# EAGLE design bbhTiny84 (EAGLE 6.4)
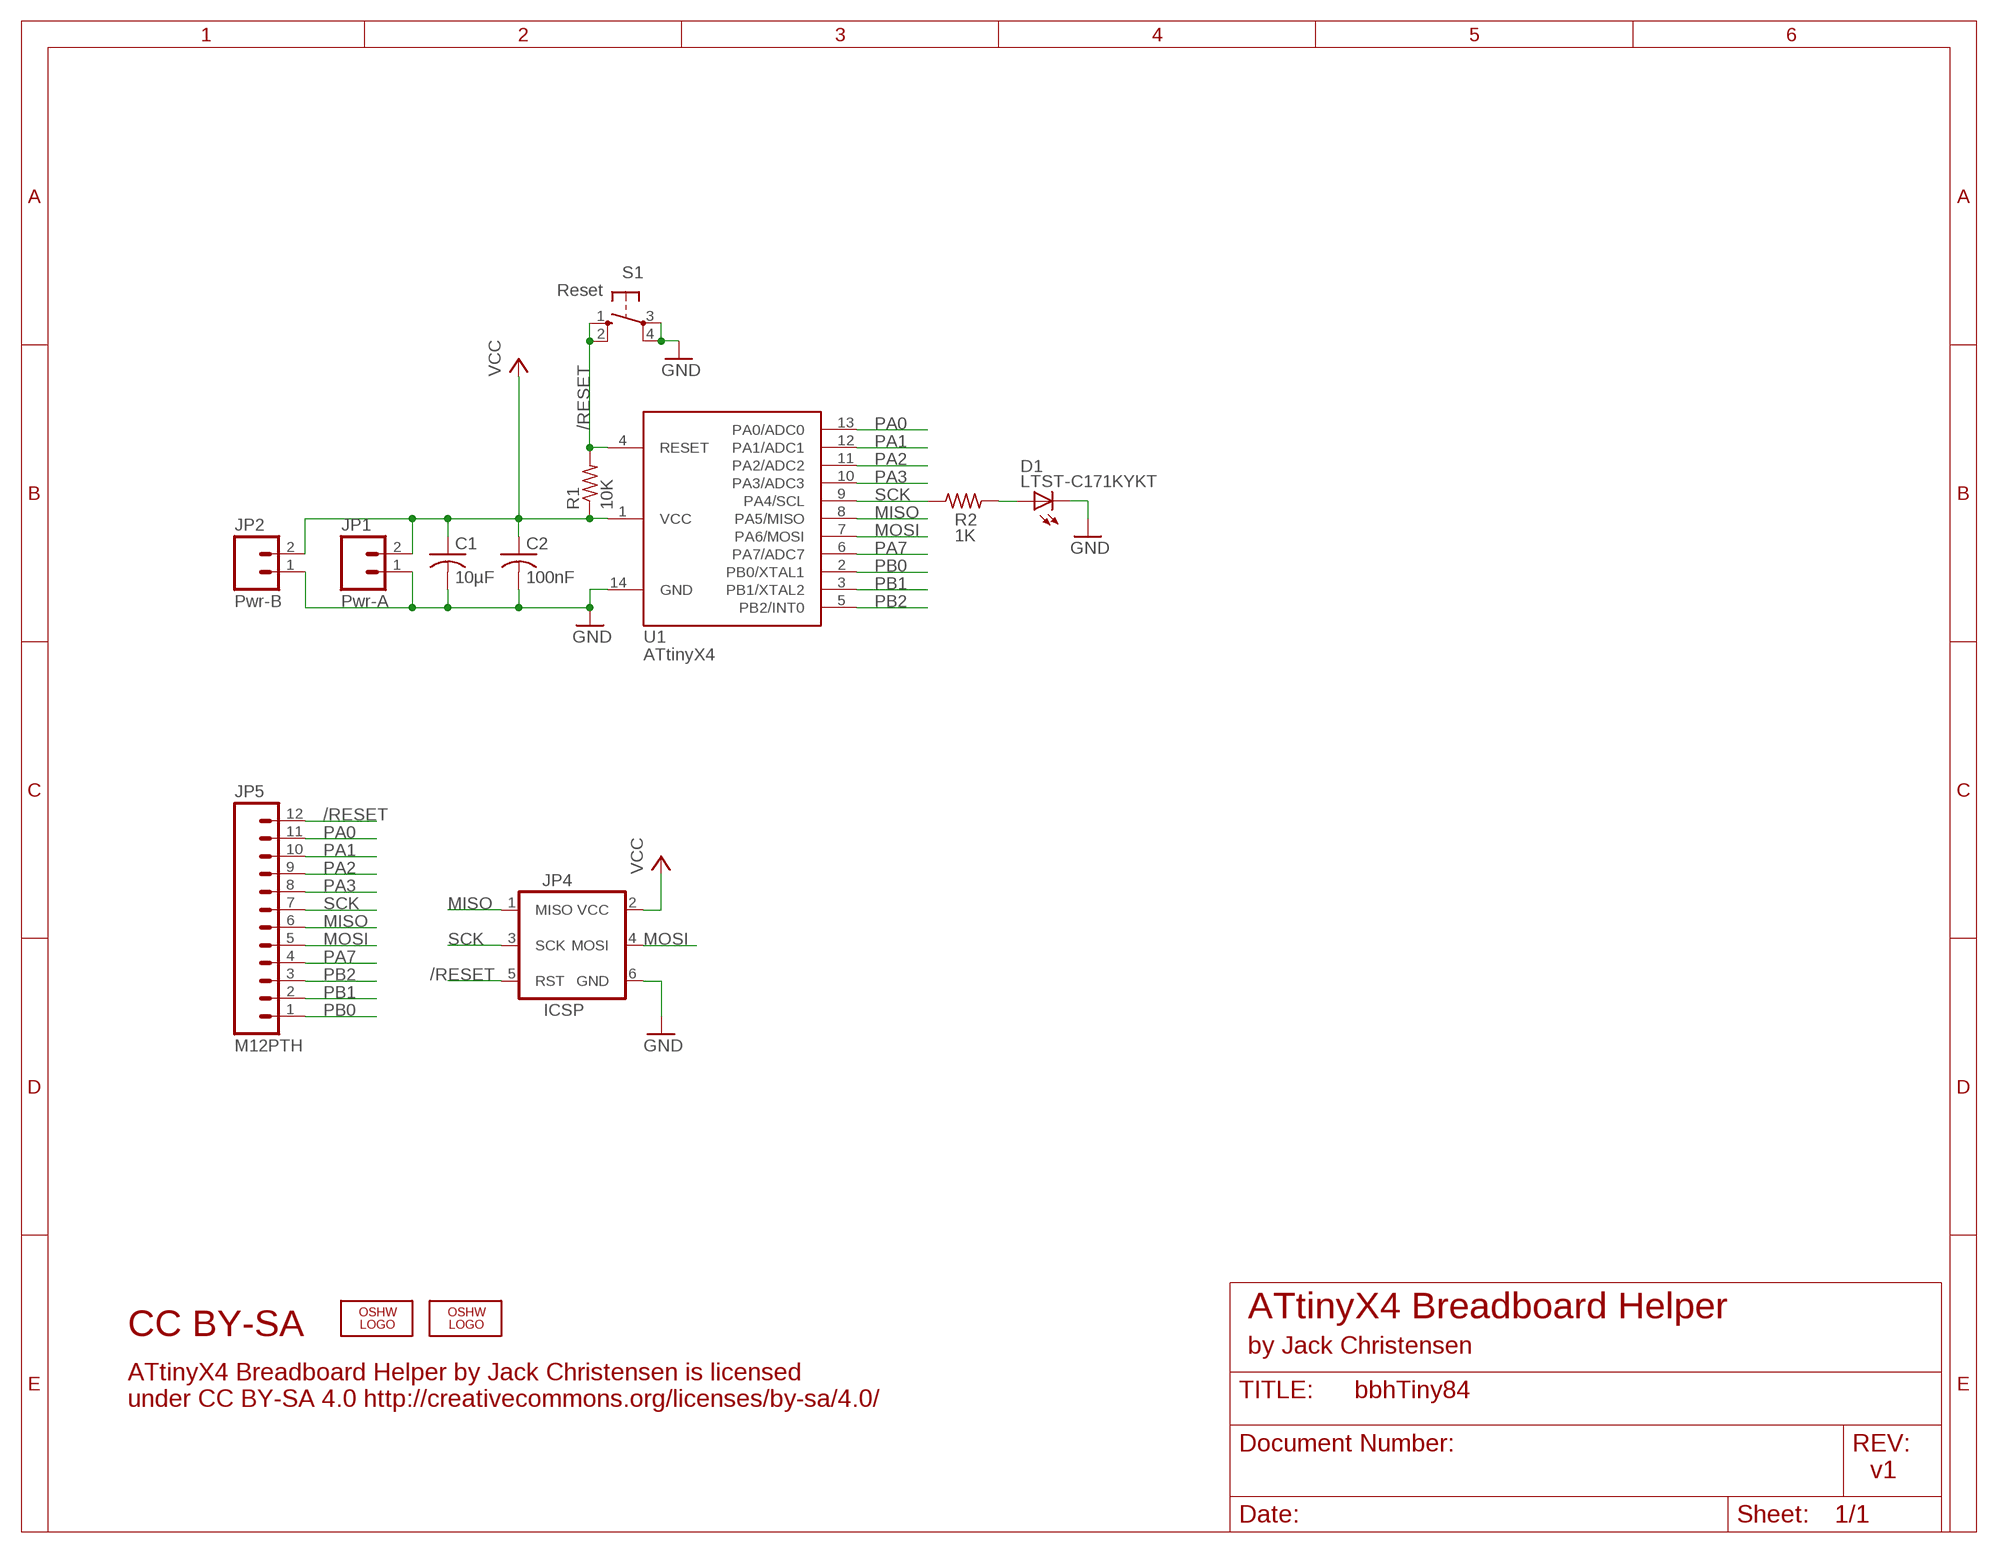
[diagram p0: schematic, sheet 1]

## Parts
C1  10µF  C-USM0805  [M0805]
C2  100nF  C-USM0805  [M0805]
D1  LTST-C171KYKT  LEDD0805  [D0805]
JP1  Pwr-A  M02PTH  [1X02]
JP2  Pwr-B  M02PTH  [1X02]
JP4  ICSP  AVR_SPI_PRG_62X3_LOCK  [2X3_LOCK]
JP5  M12PTH  [1X12]
LOGO1  OSHW_LOGO_8MILX0100-NT  [OSHW_8X100_NOTEXT]
LOGO2  OSHW_LOGO_8MILX0100-NT  [OSHW_8X100_NOTEXT]
R1  10K  R-US_M0805  [M0805]
R2  1K  R-US_M0805  [M0805]
S1  Reset  10-XXOCT  [B3F-10XXOCT]
U1  ATtinyX4  ATTINYX4DIL14  [DIL14]

## Nets
/RESET: JP4.5(RST) JP5.12 R1.2 S1.1(S) S1.2(S1) U1.4(RESET)
GND: C1.2 C2.2 D1.K(C) JP1.1 JP2.1 JP4.6(GND) S1.3(P) S1.4(P1) U1.14(GND)
MISO: JP4.1(MISO) JP5.6 U1.8(PA5/MISO)
MOSI: JP4.4(MOSI) JP5.5 U1.7(PA6/MOSI)
N$1: D1.A R2.2
PA0: JP5.11 U1.13(PA0/ADC0)
PA1: JP5.10 U1.12(PA1/ADC1)
PA2: JP5.9 U1.11(PA2/ADC2)
PA3: JP5.8 U1.10(PA3/ADC3)
PA7: JP5.4 U1.6(PA7/ADC7)
PB0: JP5.1 U1.2(PB0/XTAL1)
PB1: JP5.2 U1.3(PB1/XTAL2)
PB2: JP5.3 U1.5(PB2/INT0)
SCK: JP4.3(SCK) JP5.7 R2.1 U1.9(PA4/SCL)
VCC: C1.1 C2.1 JP1.2 JP2.2 JP4.2(VCC) R1.1 U1.1(VCC)

## Notes on the sheet
- ATtinyX4 Breadboard Helper
- CC BY-SA
- by Jack Christensen
- ATtinyX4 Breadboard Helper by Jack Christensen is licensed
  under CC BY-SA 4.0 http://creativecommons.org/licenses/by-sa/4.0/
- v1

## Library data of the parts
C1 C2 = _jc:C-US: CAPACITOR, American symbol
D1 = _jc:LED: LED OSRAM: - CHIPLED LG R971, LG N971, LY N971, LG Q971, LY Q971, LO R971, LY R971 LH N974, LH R974 LS Q976, LO Q976, LY Q976 LO Q996 - Hyper CHIPLED LW Q18S LB Q993, LB Q99A, LB R99A - SideLED LS A670, LO A670, LY A670, LG A670, LP A670 LB A673, LV A673, LT A673, LW A673 LH A674 LY A675 LS A676, LA A676, LO A676, LY A676, LW A676 LS A679, LY A679, LG A679 - Hyper Micro SIDELED® LS Y876, LA Y876, LO Y876, LY Y876 LT Y87S - SmartLED LW L88C, LW L88S LB L89C, LB L89S, LG L890 LS L89K, LO L89K, LY L89K LS L896, LA L896, LO L896, LY L896 - TOPLED LS T670, LO T670, LY T670, LG T670, LP T670 LSG T670, LSP T670, LSY T670, LOP T670, LYG T670 LG T671, LOG T671, LSG T671 LB T673, LV T673, LT T673, LW T673 LH T674 LS T676, LA T676, LO T676, LY T676, LB T676, LH T676, LSB T676, LW T676 LB T67C, LV T67C, LT T67C, LS T67K, LO T67K, LY T67K, LW E67C LS E67B, LA E67B, LO E67B, LY E67B, LB E67C, LV E67C, LT E67C LW T67C LS T679, LY T679, LG T679 LS T770, LO T770, LY T770, LG T770, LP T770 LB T773, LV T773, LT T773, LW T773 LH T774 LS E675, LA E675, LY E675, LS T675 LS T776, LA T776, LO T776, LY T776, LB T776 LHGB T686 LT T68C, LB T68C - Hyper Mini TOPLED® LB M676 - Mini TOPLED Santana® LG M470 LS M47K, LO M47K, LY M47K Source: http://www.osram.convergy.de/
JP1 JP2 = SparkFun:M02: Header 2 Standard 2-pin 0.1" header. Use with straight break away headers (SKU : PRT-00116), right angle break away headers (PRT-00553), swiss pins (PRT-00743), machine pins (PRT-00117), and female headers (PRT-00115). Molex polarized connector foot print use with SKU : PRT-08233 with associated crimp pins and housings.
JP4 = _jc:AVR_SPI_PRG_6: AVR ISP 6 Pin This is the reduced ISP connector for AVR programming. Common on Arduino. This footprint will take up less PCB space and can be used with a 10-pin to 6-pin adapter such as SKU: BOB-08508
JP5 = SparkFun:M12: Header 12 Standard 12-pin 0.1" header. Use with straight break away headers (SKU : PRT-00116), right angle break away headers (PRT-00553), swiss pins (PRT-00743), machine pins (PRT-00117), and female headers (PRT-00115).
LOGO1 LOGO2 = ohw-logo:OSHW_LOGO_8MIL
R1 R2 = _jc:R-US_: RESISTOR, American symbol
S1 = _jc:10-XX: OMRON SWITCH
U1 = _jc:ATTINYX4

## Board
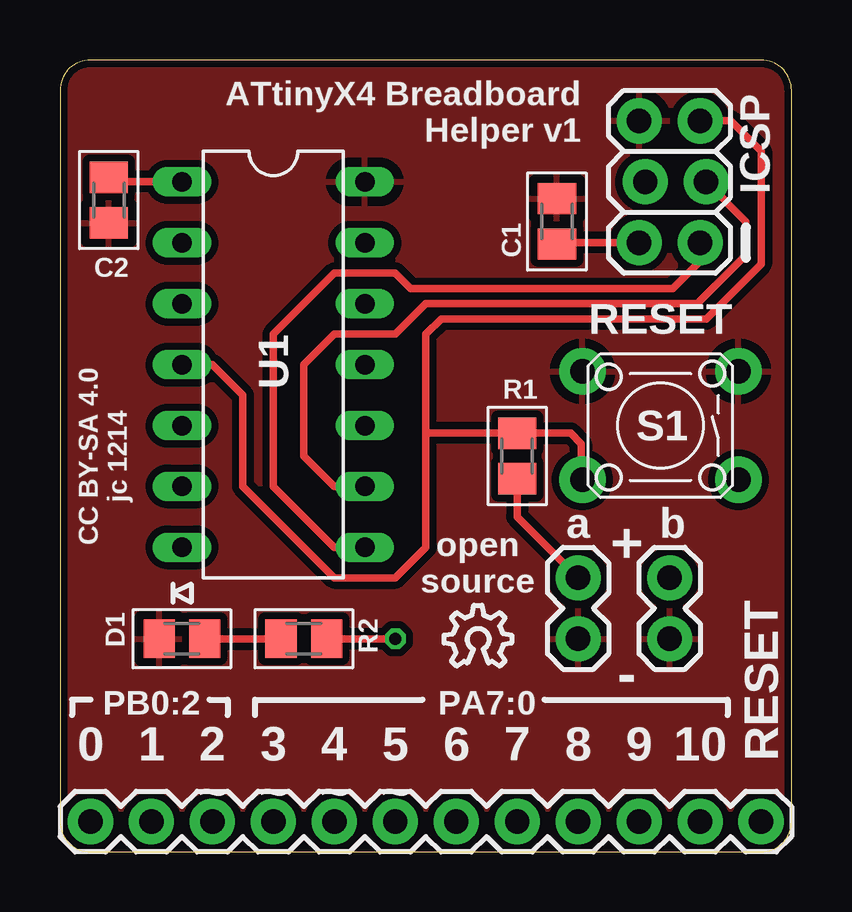
[diagram p1: board, top side]
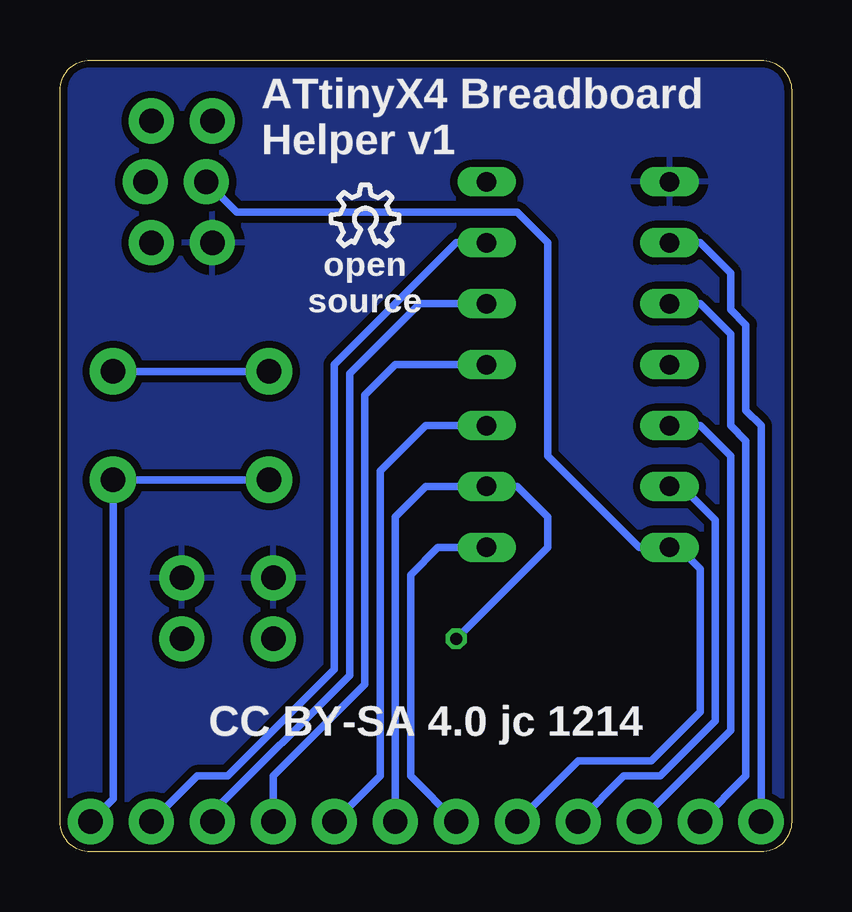
[diagram p2: board, bottom side, seen from below]

Size 30.48 x 33.02 mm. Coordinates in mm from the lower left corner, seen from the top.
Outline: 0,31.75 0,1.27 arc90 1.27,0 29.21,0 arc90 30.48,1.27 30.48,31.75 arc90 29.21,33.02 1.27,33.02 arc90 0,31.75
Copper layers (1*16): Top 0.0356mm / dielectric 1.5011mm / Bottom 0.0356mm
Design rules "LaenPCBOrder_jc1 *": minimum track width 8mil, minimum drill 13mil, track to track 8mil, track to pad 8mil, pad to pad 8mil, via to via 8mil, smd to smd 6mil, copper to edge 10mil, drill to drill 6mil, minimum pad ring 7mil, minimum via ring 7mil, stop-mask expansion 4mil, vias tented up to drill 20mil, thermal gap 16mil

### Footprints (pad centres in the part's own frame; a part is rotated, then mirrored left to right if it is on the bottom)
M0805 = smd 1.3 x 1.6: 1 -0.95,0; 2 0.95,0
D0805 = smd 1.3 x 1.6: A -0.95,0; K 0.95,0
1X02 = drill 1.016 pad 1.88: 1 0,0; 2 2.54,0
2X3_LOCK = drill 1.016 pad 1.88: 1 0,0; 2 0,2.54; 3 2.54,-0.254; 4 2.54,2.286; 5 5.08,0; 6 5.08,2.54
1X12 = drill 1.016 pad 1.88: 1 0,0; 2 2.54,0; 3 5.08,0; 4 7.62,0; 5 10.16,0; 6 12.7,0; 7 15.24,0; 8 17.78,0; 9 20.32,0; 10 22.86,0; 11 25.4,0; 12 27.94,0
B3F-10XXOCT = drill 1.016 pad 1.93: 1 -3.251,2.261; 2 3.251,2.261; 3 -3.251,-2.261; 4 3.251,-2.261
DIL14 = drill 0.813 long: 1 -7.62,-3.81; 2 -5.08,-3.81; 3 -2.54,-3.81; 4 0,-3.81; 5 2.54,-3.81; 6 5.08,-3.81; 7 7.62,-3.81; 8 7.62,3.81; 9 5.08,3.81; 10 2.54,3.81; 11 0,3.81; 12 -2.54,3.81; 13 -5.08,3.81; 14 -7.62,3.81

### Placement (x,y rotation side)
C1  20.7,26.29 90 top
C2  2.03,27.18 270 top
D1  5.08,8.89 180 top
JP1  21.59,8.89 90 top
JP2  25.4,8.89 90 top
JP4  26.67,25.4 90 top
JP5  1.27,1.27 0 top
LOGO1  16,7.75 0 top
LOGO2  19.18,25.27 0 bottom
R1  19.05,16.51 90 top
R2  10.16,8.89 180 top
S1  25.02,17.78 180 top
U1  8.89,20.32 270 top

### Tracks (layer width: path | path; a pad name or v marks a point on that pad's centre or on a via)
/RESET
  Top 0.305: U1.4 6.35,20.32 7.62,19.05 7.62,15.24 11.43,11.43 13.97,11.43 15.24,12.7 15.24,17.53 | JP4.5 27.94,30.48 29.21,29.21 29.21,24.51 26.92,22.23 15.88,22.23 15.24,21.59 15.24,17.53 | 15.24,17.53 15.31,17.46 R1.2 21.27,17.46 21.72,17.02 21.72,15.57 S1.2
  Bottom 0.305: S1.2 S1.1 28.27,2.21 JP5.12
GND
  Bottom 0.305: S1.4 S1.3
  pour Top (isolate 0.305): -2.54,35.56 33.02,35.56 33.02,-2.54 -2.54,-2.54
MISO
  Top 0.305: JP4.1 26.67,24.64 25.53,23.5 14.61,23.5 13.97,24.13 11.43,24.13 8.89,21.59 8.89,15.24 11.43,12.7 U1.8
  Bottom 0.305: JP5.6 15.88,3.17 15.88,11.56 14.73,12.7 U1.8
MOSI
  Bottom 0.305: JP4.4 23.11,26.67 11.43,26.67 10.16,25.4 10.16,16.51 6.35,12.7 U1.7 4.7,12.7 3.81,11.81 3.81,5.84 5.84,3.81 8.89,3.81 JP5.5
N$1
  Top 0.305: D1.A R2.2
PA0
  Bottom 0.305: U1.13 13.97,25.4 19.05,20.32 19.05,7.62 23.5,3.17 24.77,3.17 JP5.11
PA1
  Bottom 0.305: U1.12 15.49,22.86 18.41,19.94 18.41,7.37 24.13,1.65 JP5.10
PA2
  Bottom 0.305: U1.11 16.51,20.32 17.78,19.05 17.78,6.99 21.59,3.17 JP5.9
PA3
  Bottom 0.305: U1.10 15.24,17.78 17.14,15.88 17.14,3.17 JP5.8
PA7
  Bottom 0.305: U1.6 4.57,15.24 3.17,13.84 3.17,5.46 5.46,3.17 6.99,3.17 JP5.4
PB0
  Bottom 0.305: JP5.1 1.27,17.78 1.91,18.41 1.91,21.97 2.54,22.61 2.54,24.13 3.81,25.4 U1.2
PB1
  Bottom 0.305: JP5.2 1.91,3.17 1.91,17.14 2.54,17.78 2.54,21.59 3.81,22.86 U1.3
PB2
  Bottom 0.305: JP5.3 2.54,5.08 2.54,16.51 3.81,17.78 U1.5
SCK  (via drill 0.5)
  Top 0.305: U1.9 11.43,15.24 10.16,16.51 10.16,20.32 11.43,21.59 13.97,21.59 15.24,22.86 26.54,22.86 28.57,24.89 28.57,26.29 JP4.3 | v13.97,8.89 R2.1
  Bottom 0.305: JP5.7 16.51,13.97 15.24,15.24 U1.9 11.43,15.24 10.16,13.97 10.16,12.7 v13.97,8.89
VCC
  Top 0.305: R1.1 19.05,13.97 JP1.2 | JP4.2 20.76,25.4 C1.1 | U1.1 2.22,27.94 C2.1
  pour Bottom (isolate 0.305): -1.27,34.29 31.75,34.29 31.75,-1.27 -1.27,-1.27

### Text on the board
tPlace: ATtinyX4 Breadboard / Helper v1 | ICSP | RESET | CC BY-SA 4.0 / jc 1214 | a | b | + | open / source | - | PB0:2 | PA7:0 | 0 | 1 | 2 | 3 | 4 | 5 | 6 | 7 | 8 | 9 | 10 | RESET | ~ | ~ | ~ | ~
bPlace: ATtinyX4 Breadboard / Helper v1 | open / source | CC BY-SA 4.0 jc 1214